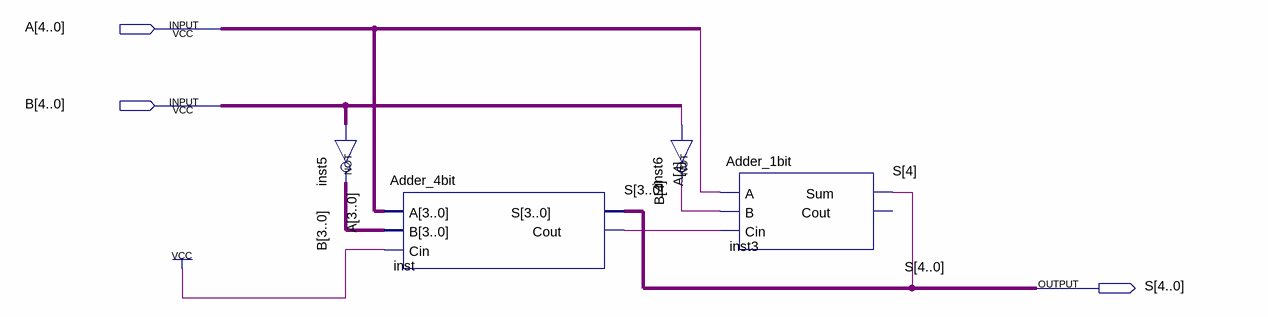
[diagram p0: schematic sheet]
// Quartus schematic Sub_5bit.bdf as structural Verilog: 4 symbols, 3 pins
module Sub_5bit (
  input  [4:0] A,
  input  [4:0] B,
  output [4:0] S
);

  wire inst6_out, inst_cout;
  wire [3:0] inst5_out;

  assign inst5_out = ~B[3:0];  // NOT inst5, 4 bits wide
  Adder_4bit inst (.A(A[3:0]), .B(inst5_out), .Cin(1'b1), .S(S[3:0]), .Cout(inst_cout));
  not inst6 (inst6_out, B[4]);
  Adder_1bit inst3 (.A(A[4]), .B(inst6_out), .Cin(inst_cout), .Sum(S[4]));  // open: Cout
endmodule
